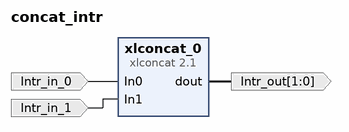
[diagram p0: block diagram of the top level]
# Vivado block design concat_intr, xc7z020clg484-1, Vivado 2022.1
create_bd_design concat_intr

create_bd_port -dir I -type intr Intr_in_0
create_bd_port -dir I -type intr Intr_in_1
create_bd_port -dir O -from 1 -to 0 -type intr Intr_out

create_bd_cell -type ip -vlnv xilinx.com:ip:xlconcat:2.1 xlconcat_0

# ---- connections ----

connect_bd_net -net Intr_in_0_1 [get_bd_ports Intr_in_0] [get_bd_pins xlconcat_0/In0]
connect_bd_net -net Intr_in_1_1 [get_bd_ports Intr_in_1] [get_bd_pins xlconcat_0/In1]
connect_bd_net [get_bd_pins xlconcat_0/dout] [get_bd_ports Intr_out]

validate_bd_design
save_bd_design
